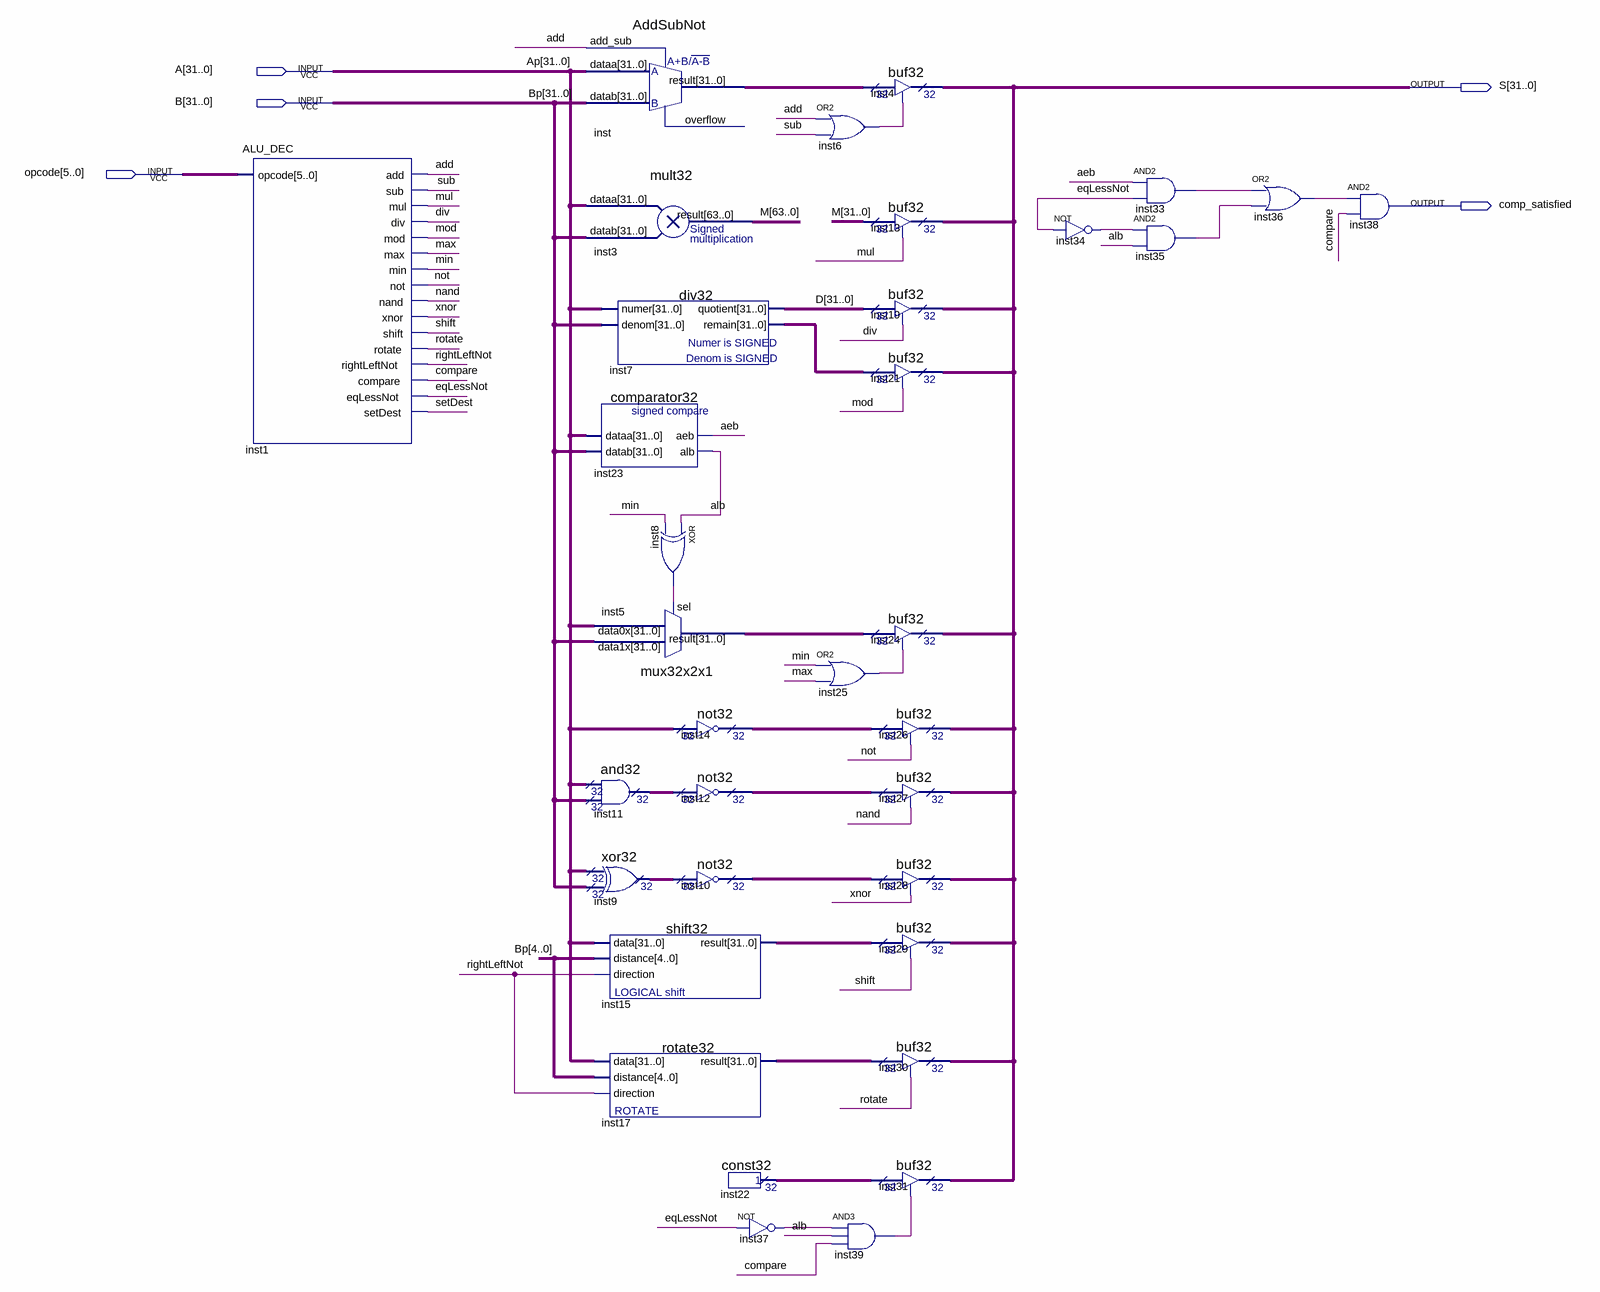
[diagram p0: schematic sheet]
// Quartus schematic ALU.bdf as structural Verilog: 35 symbols, 5 pins
module ALU (
  input  [31:0] A,
  input  [31:0] B,
  input  [5:0] opcode,
  output [31:0] S,
  output comp_satisfied
);

  wire add, aeb, alb, compare, div, eqLessNot, inst6_out, inst8_out, inst25_out, inst33_out, inst34_out,
       inst35_out, inst36_out, inst37_out, inst39_out, max, min, mod, mul, \nand , \not , rightLeftNot,
       rotate, setDest, shift, sub, \xnor ;
  wire [31:0] D, inst5_result, inst7_remain, inst9_result, inst10_result, inst11_result, inst12_result,
       inst14_result, inst15_result, inst17_result, inst22_result, inst_result;
  wire [63:0] M;

  ALU_DEC inst1 (
    .opcode(opcode), .add(add), .sub(sub), .mul(mul), .div(div), .mod(mod), .max(max), .min(min),
    .\not (\not ), .\nand (\nand ), .\xnor (\xnor ), .shift(shift), .rotate(rotate),
    .rightLeftNot(rightLeftNot), .compare(compare), .eqLessNot(eqLessNot), .setDest(setDest));
  AddSubNot inst (.dataa(A), .datab(B), .add_sub(add), .result(inst_result));  // open: overflow
  mult32 inst3 (.dataa(A), .datab(B), .result(M));
  div32 inst7 (.numer(A), .denom(B), .quotient(D), .remain(inst7_remain));
  comparator32 inst23 (.dataa(A), .datab(B), .aeb(aeb), .alb(alb));
  mux32x2x1 inst5 (.data1x(B), .data0x(A), .sel(inst8_out), .result(inst5_result));
  and32 inst11 (.data0x(A), .data1x(B), .result(inst11_result));
  xor32 inst9 (.data0x(A), .data1x(B), .result(inst9_result));
  shift32 inst15 (.data(A), .distance(B[4:0]), .direction(rightLeftNot), .result(inst15_result));
  rotate32 inst17 (.data(A), .distance(B[4:0]), .direction(rightLeftNot), .result(inst17_result));
  xor inst8 (inst8_out, alb, min);
  not32 inst14 (.data(A), .result(inst14_result));
  not32 inst12 (.data(inst11_result), .result(inst12_result));
  not32 inst10 (.data(inst9_result), .result(inst10_result));
  const32 inst22 (.result(inst22_result));
  not inst37 (inst37_out, eqLessNot);
  or inst6 (inst6_out, add, sub);
  or inst25 (inst25_out, min, max);
  buf32 inst4 (.enabledt(inst6_out), .data(inst_result), .tridata(S));
  buf32 inst13 (.enabledt(mul), .data(M[31:0]), .tridata(S));
  buf32 inst19 (.enabledt(div), .data(D), .tridata(S));
  buf32 inst21 (.enabledt(mod), .data(inst7_remain), .tridata(S));
  buf32 inst24 (.enabledt(inst25_out), .data(inst5_result), .tridata(S));
  buf32 inst26 (.enabledt(\not ), .data(inst14_result), .tridata(S));
  buf32 inst27 (.enabledt(\nand ), .data(inst12_result), .tridata(S));
  buf32 inst28 (.enabledt(\xnor ), .data(inst10_result), .tridata(S));
  buf32 inst29 (.enabledt(shift), .data(inst15_result), .tridata(S));
  buf32 inst30 (.enabledt(rotate), .data(inst17_result), .tridata(S));
  buf32 inst31 (.enabledt(inst39_out), .data(inst22_result), .tridata(S));
  and inst39 (inst39_out, inst37_out, alb, compare);
  not inst34 (inst34_out, eqLessNot);
  and inst33 (inst33_out, aeb, eqLessNot);
  and inst35 (inst35_out, inst34_out, alb);
  or inst36 (inst36_out, inst33_out, inst35_out);
  and inst38 (comp_satisfied, inst36_out, compare);

  // Other names for the same wires on the sheet: Ap[31:0] = A; Bp[31:0] = B
endmodule
